# Altium schematic sheet 5VD_and_5VDC_and_12V.SchDoc
size A4; SheetNumber: 2; SheetTotal: 7
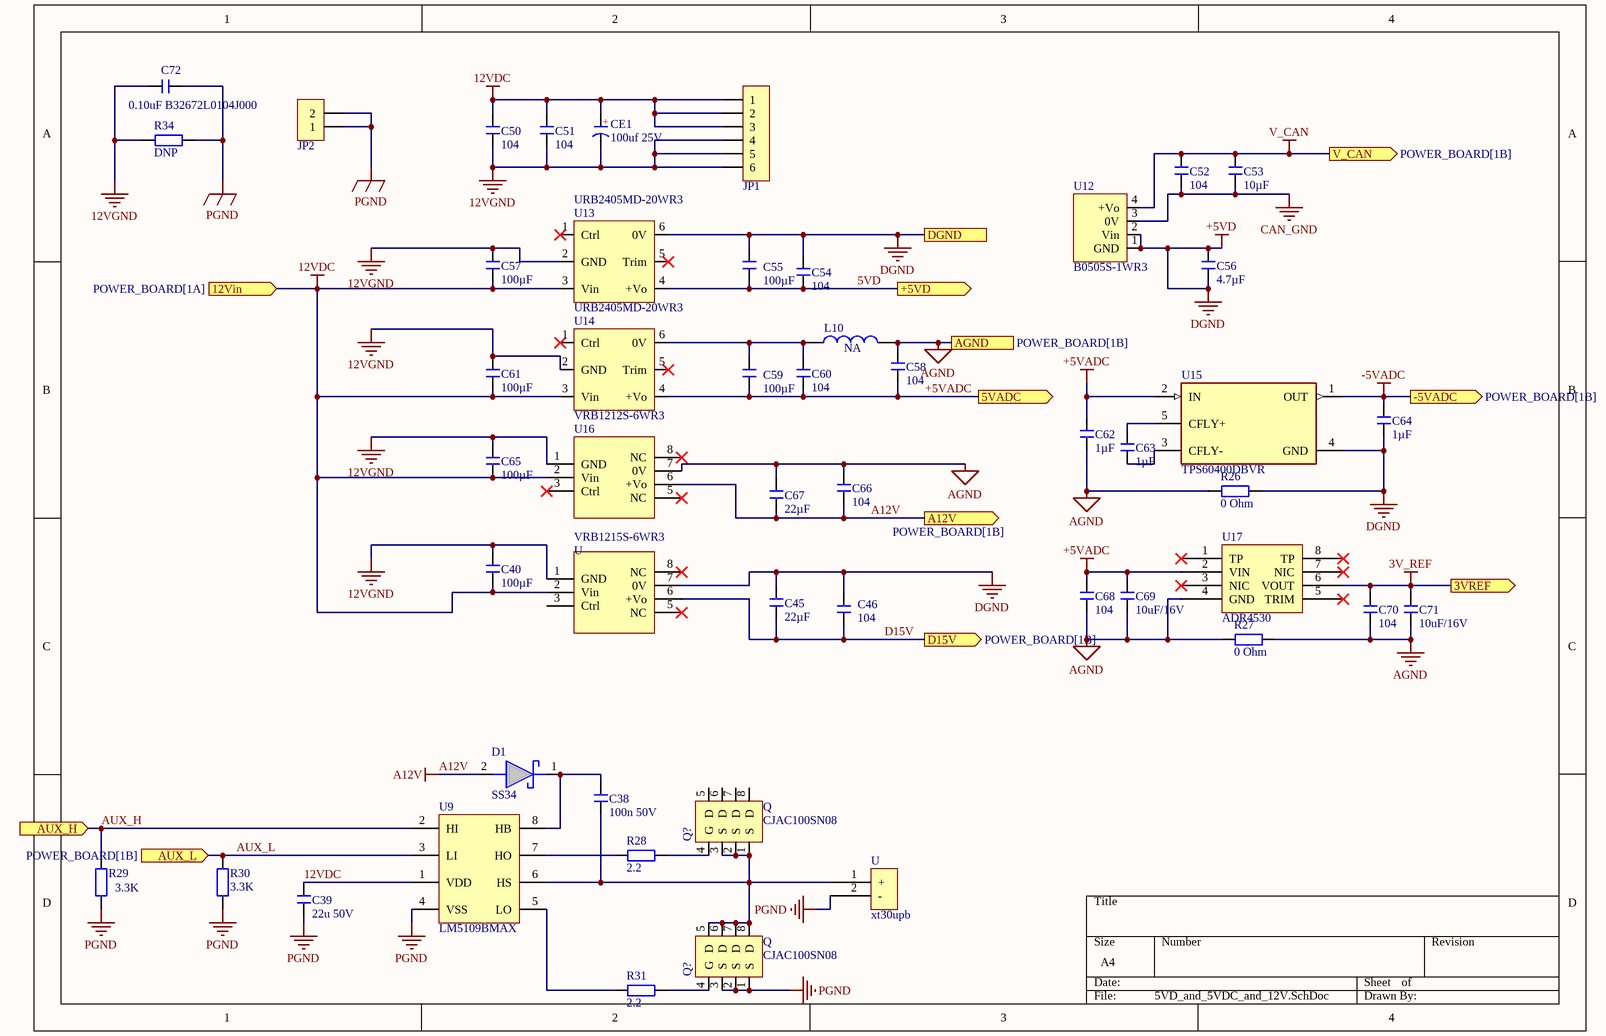
[diagram p0: 5VD_and_5VDC_and_12V.SchDoc]

## Parts
(Parts that share a designator on the sheet are numbered #1, #2 ... from top to bottom, then left to right.)
C38  100n 50V  [C 0805_L]
C39  22u 50V  [C 0805_L]
C40  100µF  [C 0805_L]
C45  22µF  [C 0805_L]
C46  104  [C 0805_L]
C50  104  [C 0805_L]
C51  104  [C 0805_L]
C52  104  [C 0805_L]
C53  10µF  [C 0805_L]
C54  104  [C 0805_L]
C55  100µF  [C 0805_L]
C56  4.7µF  [C 0805_L]
C57  100µF  [C 0805_L]
C58  104  [C 0805_L]
C59  100µF  [C 0805_L]
C60  104  [C 0805_L]
C61  100µF  [C 0805_L]
C62  1µF  [C 0805_L]
C63  1µF  [C 0805_L]
C64  1µF  [C 0805_L]
C65  100µF  [C 0805_L]
C66  104  [C 0805_L]
C67  22µF  [C 0805_L]
C68  104  [C 0805_L]
C69  10uF/16V  [C 0805_L]
C70  104  [C 0805_L]
C71  10uF/16V  [C 0805_L]
C72  0.10uF B32672L0104J000  [C 0805_L]
CE1  100uf 25V  [CAP 1.5*4*8]
D1  SS34  [DIOM8059X256N]
JP1  HDR-1X6  [KF128-3.81-6P]  (value not drawn)
JP2  HDR-1X2  [KF7620-2P]  (value not drawn)
L10  NA  [L 0805]
Q#1  CJAC100SN08
Q#2  CJAC100SN08
R26  0 Ohm  [R 0805_L]
R27  0 Ohm  [R 0805_L]
R28  2.2  [R 0805_L]
R29  3.3K  [R 0805_L]
R30  3.3K  [R 0805_L]
R31  2.2  [R 0805_L]
R34  DNP  [R 0805_L]
U9  LM5109BMAX  [M08A_M]
U12  B0505S-1WR3
U13  URB2405MD-20WR3  [URB_YMD-20WR3]
U14  URB2405MD-20WR3  [URB_YMD-20WR3]
U15  TPS60400DBVR  [FP-DBV0005A-MFG]
U16  VRB1212S-6WR3
U17  ADR4530
U#1  VRB1215S-6WR3
U#2  xt30upb

## Ports
3VREF (out, see POWER_BOARD[1B]), 5VADC (out, see POWER_BOARD[1A]), 12Vin (in, see POWER_BOARD[1A]), +5VD (out, see POWER_BOARD[1A], 1VD, 1.5VD, 1.8VD, 3.3VD, 3.3VA[1B], VTTVREF[1B]), -5VADC (out, see POWER_BOARD[1B]), A12V (out, see POWER_BOARD[1B]), AGND (see POWER_BOARD[1B]), AUX_H (in, see POWER_BOARD[1B]), AUX_L (in, see POWER_BOARD[1B]), D15V (out, see POWER_BOARD[1B]), DGND (see POWER_BOARD[1B]), V_CAN (out, see POWER_BOARD[1B])

## Nets
3V_REF: C70.2 C71.2 U17.6(VOUT) ; port 3VREF
12VDC: C39.2 C40.1 C50.1 C51.1 C57.2 C61.2 C65.1 CE1.1(A) JP1.1 JP1.2 JP1.3 U9.1(VDD) U13.3(Vin) U14.3(Vin) U16.2(Vin) U#1.2(Vin) ; port 12Vin
12VGND: C40.2 C50.2 C51.2 C57.1 C61.1 C65.2 C72.1 CE1.2(K) JP1.4 JP1.5 JP1.6 R34.1 U13.2(GND) U14.2(GND) U16.1(GND) U#1.1(GND)
+5VADC: C58.1 C59.1 C60.2 C62.2 C68.2 C69.2 U14.4(+Vo) U15.2(IN) U17.2(VIN) ; port 5VADC
+5VD: C45.1 C46.2 C54.2 C55.2 C56.1 C56.2 C64.1 R26.2 U12.1(GND) U12.2(Vin) U13.6(0V) U15.4(GND) U#1.7(0V) ; port DGND  [also labelled DGND]
-5VADC: C64.2 U15.1(OUT) ; port -5VADC
A12V: C66.1 C67.2 D1.2(A) U16.6(+Vo) ; port A12V
AGND: C58.2 C62.1 C66.2 C67.1 C68.1 C69.1 C70.1 C71.1 L10.2 R26.1 R27.1 R27.2 U16.7(0V) U17.4(GND) ; port AGND
CAN_GND: C52.1 C53.1 U12.3(0V)
PGND: C39.1 C72.2 JP2.1 JP2.2 Q#2.1(S) Q#2.2(S) Q#2.3(S) R29.1 R30.1 R34.2 U9.4(VSS) U#2.2(-)
V_CAN: C52.2 C53.2 U12.4(+Vo) ; port V_CAN
5VD: C54.1 C55.1 U13.4(+Vo) ; port +5VD
AUX_H: R29.2 U9.2(HI) ; port AUX_H
AUX_L: R30.2 U9.3(LI) ; port AUX_L
D15V: C45.2 C46.1 U#1.6(+Vo) ; port D15V
NetC38_1: C38.1 Q#1.1(S) Q#1.2(S) Q#1.3(S) Q#2.5(D) Q#2.6(D) Q#2.7(D) Q#2.8(D) U9.6(HS) U#2.1(+)
NetC38_2: C38.2 D1.1(K) U9.8(HB)
NetC59_2: C59.2 C60.1 L10.1 U14.6(0V)
NetC63_1: C63.1 U15.3(CFLY-)
NetC63_2: C63.2 U15.5(CFLY+)
NetQ#1_4: Q#1.4(G) R28.2
NetQ#2_4: Q#2.4(G) R31.2
NetR28_1: R28.1 U9.7(HO)
NetR31_1: R31.1 U9.5(LO)

Not connected (* = marked no-connect by the designer): Q#1 5(D) 6(D) 7(D) 8(D); U13 1(Ctrl)* 5(Trim)*; U14 1(Ctrl)* 5(Trim)*; U16 3(Ctrl)* 5(NC)* 8(NC)*; U17 1(TP)* 3(NIC)* 5(TRIM)* 7(NIC)* 8(TP)*; U#1 3(Ctrl) 5(NC)* 8(NC)*

## Notes on the sheet
- (in symbol CE) +
- (in symbol CJAC100SN08) Q?

## Library data of the parts
C38 C39 C46 C50-C52 C54 C58 C60 C66 C68-C71 = C: 贴片电容; BOM名称: 无极性贴片电容; 淘宝ID: 封装库来自淘宝 ID：黄晶宝石; 联系售后，技术支持: https://shop463601444.taobao.com; 唯一出售店铺网址: https://shop463601444.taobao.com
C40 C57 C61-C65 = C: 贴片电容 100µF/50V; BOM名称: 无极性贴片电容; 淘宝ID: 封装库来自淘宝 ID：黄晶宝石; 联系售后，技术支持: https://shop463601444.taobao.com; 唯一出售店铺网址: https://shop463601444.taobao.com
C45 C67 = C: 贴片电容 22µF/50V; BOM名称: 无极性贴片电容; 淘宝ID: 封装库来自淘宝 ID：黄晶宝石; 联系售后，技术支持: https://shop463601444.taobao.com; 唯一出售店铺网址: https://shop463601444.taobao.com
C53 = C: 贴片电容 10µF/16V; BOM名称: 无极性贴片电容; 淘宝ID: 封装库来自淘宝 ID：黄晶宝石; 联系售后，技术支持: https://shop463601444.taobao.com; 唯一出售店铺网址: https://shop463601444.taobao.com
C55 C59 = C: 贴片电容 100µF/16V; BOM名称: 无极性贴片电容; 淘宝ID: 封装库来自淘宝 ID：黄晶宝石; 联系售后，技术支持: https://shop463601444.taobao.com; 唯一出售店铺网址: https://shop463601444.taobao.com
C56 = C: 贴片电容 4.7µF/16V; BOM名称: 无极性贴片电容; 淘宝ID: 封装库来自淘宝 ID：黄晶宝石; 联系售后，技术支持: https://shop463601444.taobao.com; 唯一出售店铺网址: https://shop463601444.taobao.com
C72 = C: through hole电容 薄膜電容器 FILM CAP MKP BOX 0.10uF 5% 1000V LS 15mm; BOM名称: 无极性贴片电容; 淘宝ID: 封装库来自淘宝 ID：黄晶宝石; 联系售后，技术支持: https://shop463601444.taobao.com; 唯一出售店铺网址: https://shop463601444.taobao.com
CE1 = CE: 直插电解电容  贴片铝电,d=6MM; 淘宝ID: 封装库来自淘宝 ID：黄晶宝石; BOM名称: 直插电解电容; 联系售后: https://shop463601444.taobao.com
D1 = SS34: ON Semi SS34 SMT Schottky Diode, 40V 3A, 2-Pin DO-214AB; Manufacturer_Name: onsemi; Geometry.Height: 2.56mm; Mouser Part Number: 512-SS34; Mouser Price/Stock: https://www.mouser.co.uk/ProductDetail/onsemi-Fairchild/SS34?qs=2ONuHmP%2FXzb3ub11UdFfdQ%3D%3D; Manufacturer_Part_Number: SS34; Datasheet Link: https://componentsearchengine.com/Datasheets/2/SS34.pdf
JP1 = Header 6: 6P接插件 3.81; 版权归属: 源创客; BOM名称: 6P接插件; 学习资源: www.ooocke.com
JP2 = Header 2: 2P接插件; 版权归属: 封装库来自淘宝 ID：黄晶宝石; BOM名称: 2P接插件; 技术支持，联系售后: https://shop463601444.taobao.com
L10 = L: 小功率贴片电感 CIB31P310 31 Ohms @ 100 MHz; 淘宝ID: 封装库来自淘宝 ID：黄晶宝石; 封装库来自淘宝卖家 ID：黄晶宝石: 其他店铺购入均为盗版，不享受售后技术支持服务，请立即申请退款; BOM名称: 小功率贴片电感; 联系售后: https://shop463601444.taobao.com
R26-R31 R34 = R: 贴片电阻; 版权归属: 来自淘宝 ID：黄晶宝石; 封装库来自淘宝卖家 ID：黄晶宝石: 其他店铺购入均为盗版，不享受售后技术支持服务，请立即申请退款; BOM名称: 贴片电阻; 联系售后: https://shop463601444.taobao.com
U9 = CMP-0063-00512-2: High Voltage 1A Peak Half Bridge Gate Driver, 8-pin Narrow SOIC; Manufacturer: National Semiconductor; PowerWise: N; PackageTopMarking: NSZXTT*L5109*BMA; CompType: MiscPower; ComponentLink2URL: http://www.national.com/pf/LM/LM5109B.html; PackageReference: M08A; Code_IPC: SOIC127P600-8; ComponentLink1Description: LM5109B Datasheet; ComponentLink1URL: http://www.national.com/ds/LM/LM5109B.pdf; ComponentLink3Description: M08A Package Page; RoHS: N; ComponentLink3URL: http://www.national.com/packaging/folders/m08a.html; ComponentLink2Description: LM5109B Web Page; DatasheetVersion: Feb-2007; PinCount: 8; RevisionNote: Component URLs added; Code_JEDEC: MS-012-AA; PackageVersion: revM, May-2009; PackageDescription: SOIC Narrow, 4.9 x 3.9 x 1.45mm, 8 Lead, 1.27mm Pitch
U12 = B_S-1WR3
U13 U14 = URB_YMD-20WR3
U15 = CMP-0391-00019-3: IC REG CHARG PUMP INV 60MA SOT23; Number of Outputs: 1; Min Supply Voltage: 1.8V; Max Supply Voltage: 5.25V; Max Output Voltage: -5.25V; Operating Supply Current: 125uA; Logic Function: Inverting; Min Output Voltage: -1.6V; Output Type: Adjustable; Switching Frequency: 250kHz; Synchronous Rectifier: No; Min Operating Temperature: -40°C; Number of Pins: 5; Package Quantity: 3000; Min Input Voltage: 1.8V; Max Operating Temperature: 85°C; Packaging: Tape and Reel; Output Current: 60mA; Max Input Voltage: 5.25V; Weight: 0.000459oz; Lead Free: Lead Free; Output Voltage: -5.25V; Contact Plating: Gold; Radiation Hardening: No; Quiescent Current: 125uA; Max Output Current: 60mA; REACH SVHC: No SVHC; Case/Package: SOT-23-5
U16 U#1 = VRB_S-6WR3
U17 = ADR4530: 3V Voltage Reference from Analog Devices